# EAGLE design tree2023 (EAGLE 9.6.2)
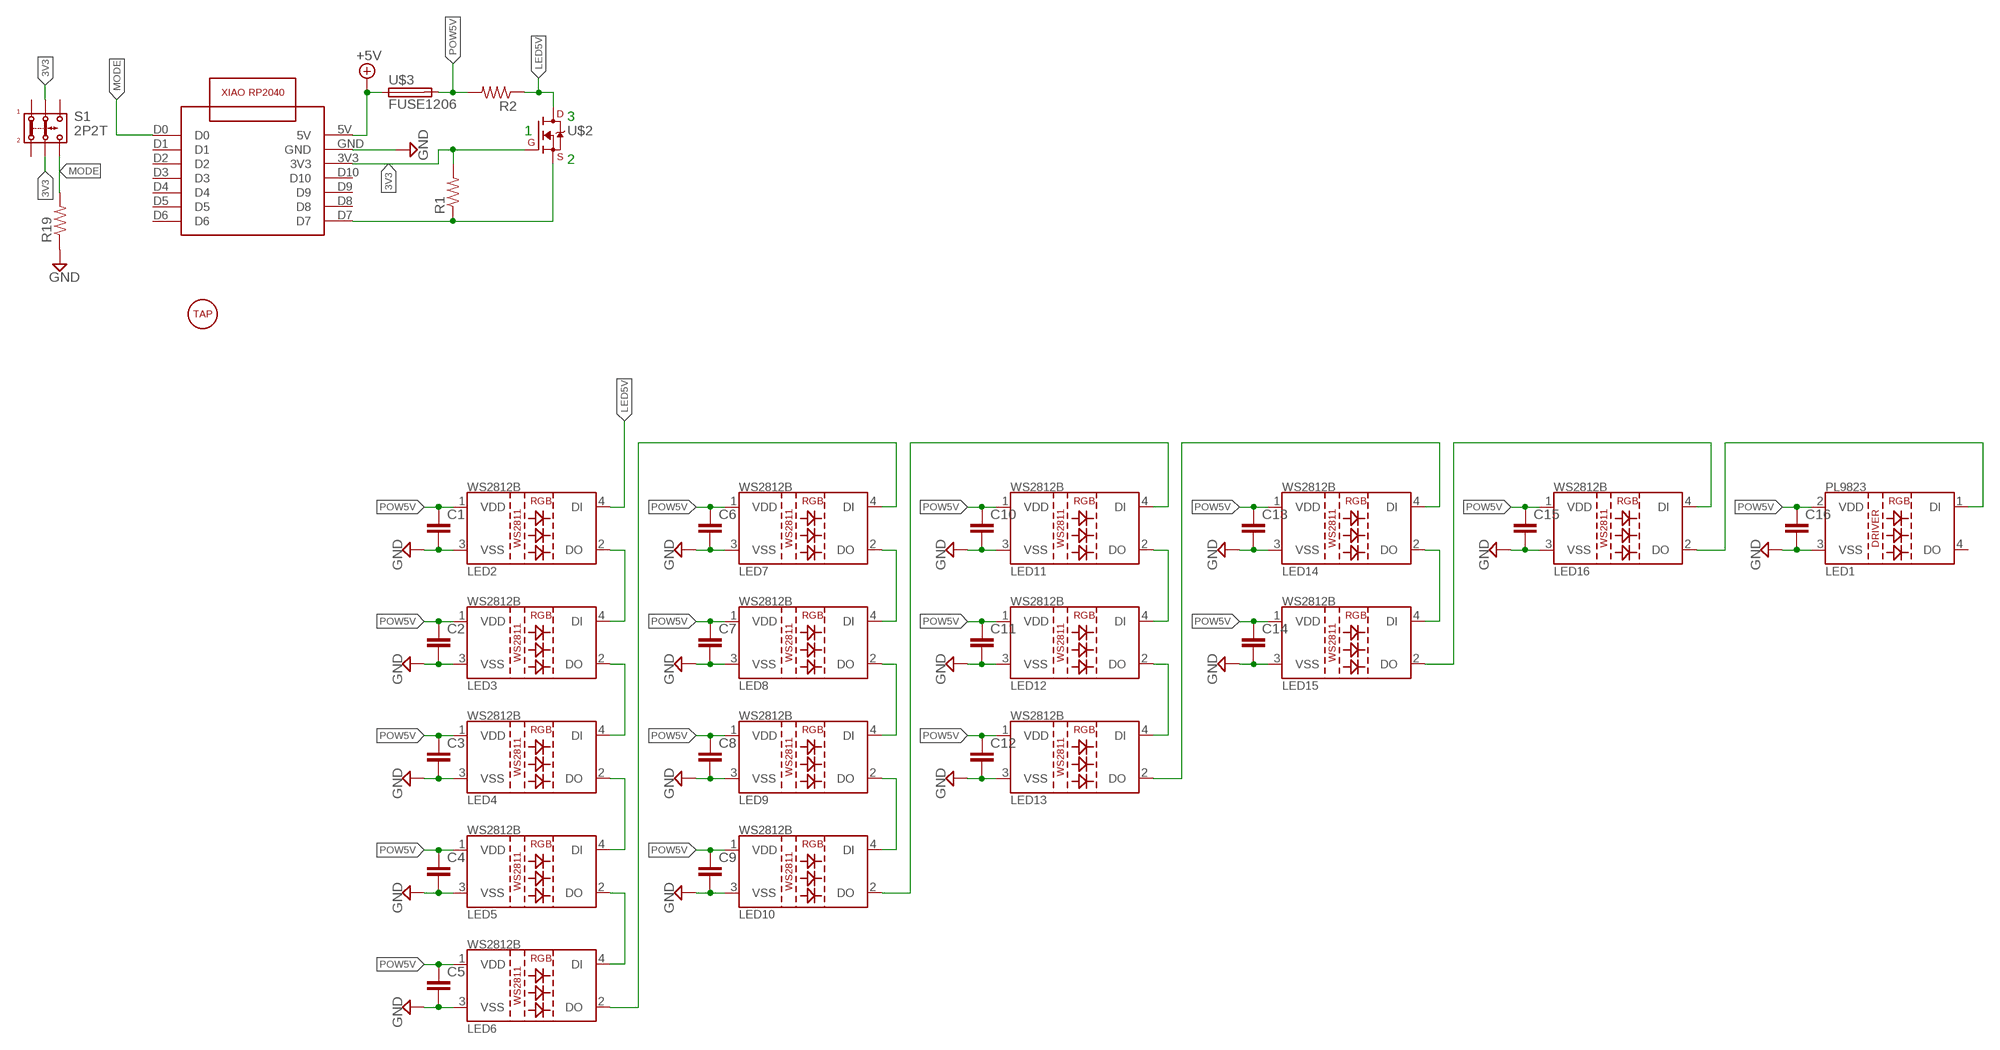
[diagram p0: schematic, sheet 1]

## Parts
C1  C-EUC0805  [C0805]
C2  C-EUC0805  [C0805]
C3  C-EUC0805  [C0805]
C4  C-EUC0805  [C0805]
C5  C-EUC0805  [C0805]
C6  C-EUC0805  [C0805]
C7  C-EUC0805  [C0805]
C8  C-EUC0805  [C0805]
C9  C-EUC0805  [C0805]
C10  C-EUC0805  [C0805]
C11  C-EUC0805  [C0805]
C12  C-EUC0805  [C0805]
C13  C-EUC0805  [C0805]
C14  C-EUC0805  [C0805]
C15  C-EUC0805  [C0805]
C16  C-EUC0805  [C0805]
LED1  LED-PL9823-F5  [LED-PL9823-F5]
LED2  LED-WS2812B  [LED-WS2812B]
LED3  LED-WS2812B  [LED-WS2812B]
LED4  LED-WS2812B  [LED-WS2812B]
LED5  LED-WS2812B  [LED-WS2812B]
LED6  LED-WS2812B  [LED-WS2812B]
LED7  LED-WS2812B  [LED-WS2812B]
LED8  LED-WS2812B  [LED-WS2812B]
LED9  LED-WS2812B  [LED-WS2812B]
LED10  LED-WS2812B  [LED-WS2812B]
LED11  LED-WS2812B  [LED-WS2812B]
LED12  LED-WS2812B  [LED-WS2812B]
LED13  LED-WS2812B  [LED-WS2812B]
LED14  LED-WS2812B  [LED-WS2812B]
LED15  LED-WS2812B  [LED-WS2812B]
LED16  LED-WS2812B  [LED-WS2812B]
R1  R-US_R0603  [R0603]
R2  R-US_R0603  [R0603]
R19  R-US_R0603  [R0603]
S1  2P2T  [2P2T]
U$1  XIAO-RP2040FRONT-SMD  [XIAO-RP2040-ASIDE-SMD]
U$2  IRML6344  [SOT23]
U$3  FUSE1206  [F1206]
U$4  TAPHOLE3MM  [TAPHOLE-3MM]

## Nets
3V3: R1.2 S1.2.1 S1.2.2 U$1.3V3 U$2.1(G)
+5V: U$1.5V U$3.1
GND: C1.2 C2.2 C3.2 C4.2 C5.2 C6.2 C7.2 C8.2 C9.2 C10.2 C11.2 C12.2 C13.2 C14.2 C15.2 C16.2 LED1.3(VSS) LED2.3(VSS) LED3.3(VSS) LED4.3(VSS) LED5.3(VSS) LED6.3(VSS) LED7.3(VSS) LED8.3(VSS) LED9.3(VSS) LED10.3(VSS) LED11.3(VSS) LED12.3(VSS) LED13.3(VSS) LED14.3(VSS) LED15.3(VSS) LED16.3(VSS) R19.1 U$1.GND
LED5V: LED2.4(DI) R2.1 U$2.3(D)
MODE: R19.2 S1.3.2 U$1.D0
N$1: LED2.2(DO) LED3.4(DI)
N$2: LED3.2(DO) LED4.4(DI)
N$3: LED4.2(DO) LED5.4(DI)
N$4: LED5.2(DO) LED6.4(DI)
N$5: LED6.2(DO) LED7.4(DI)
N$6: LED7.2(DO) LED8.4(DI)
N$7: LED8.2(DO) LED9.4(DI)
N$8: LED9.2(DO) LED10.4(DI)
N$9: LED10.2(DO) LED11.4(DI)
N$10: LED11.2(DO) LED12.4(DI)
N$11: LED12.2(DO) LED13.4(DI)
N$12: LED13.2(DO) LED14.4(DI)
N$13: LED14.2(DO) LED15.4(DI)
N$14: LED15.2(DO) LED16.4(DI)
N$15: LED1.1(DI) LED16.2(DO)
N$18: R1.1 U$1.D7 U$2.2(S)
POW5V: C1.1 C2.1 C3.1 C4.1 C5.1 C6.1 C7.1 C8.1 C9.1 C10.1 C11.1 C12.1 C13.1 C14.1 C15.1 C16.1 LED1.2(VDD) LED2.1(VDD) LED3.1(VDD) LED4.1(VDD) LED5.1(VDD) LED6.1(VDD) LED7.1(VDD) LED8.1(VDD) LED9.1(VDD) LED10.1(VDD) LED11.1(VDD) LED12.1(VDD) LED13.1(VDD) LED14.1(VDD) LED15.1(VDD) LED16.1(VDD) R2.2 U$3.2
Unconnected: LED1.4(DO) S1.1.1 S1.1.2 S1.3.1 U$1.D1 U$1.D2 U$1.D3 U$1.D4 U$1.D5 U$1.D6 U$1.D8 U$1.D9 U$1.D10

## Notes on the sheet
- 3
- 1
- 2

## Library data of the parts
C1-C16 = 0my:C-EU: CAPACITOR, European symbol
LED1 = Ai_LED:LED-PL9823
LED2-LED16 = Ai_LED:LED-WS2812B
R1 R2 R19 = 0my:R-US_: RESISTOR, American symbol
S1 = 0my:2P2T: SLIDE SWITCH DPDT SMD
U$1 = rp2040:XIAO-RP2040
U$2 = xiao:IRML6344
U$3 = ch552:FUSE
U$4 = 0my:TAPHOLE

## Board
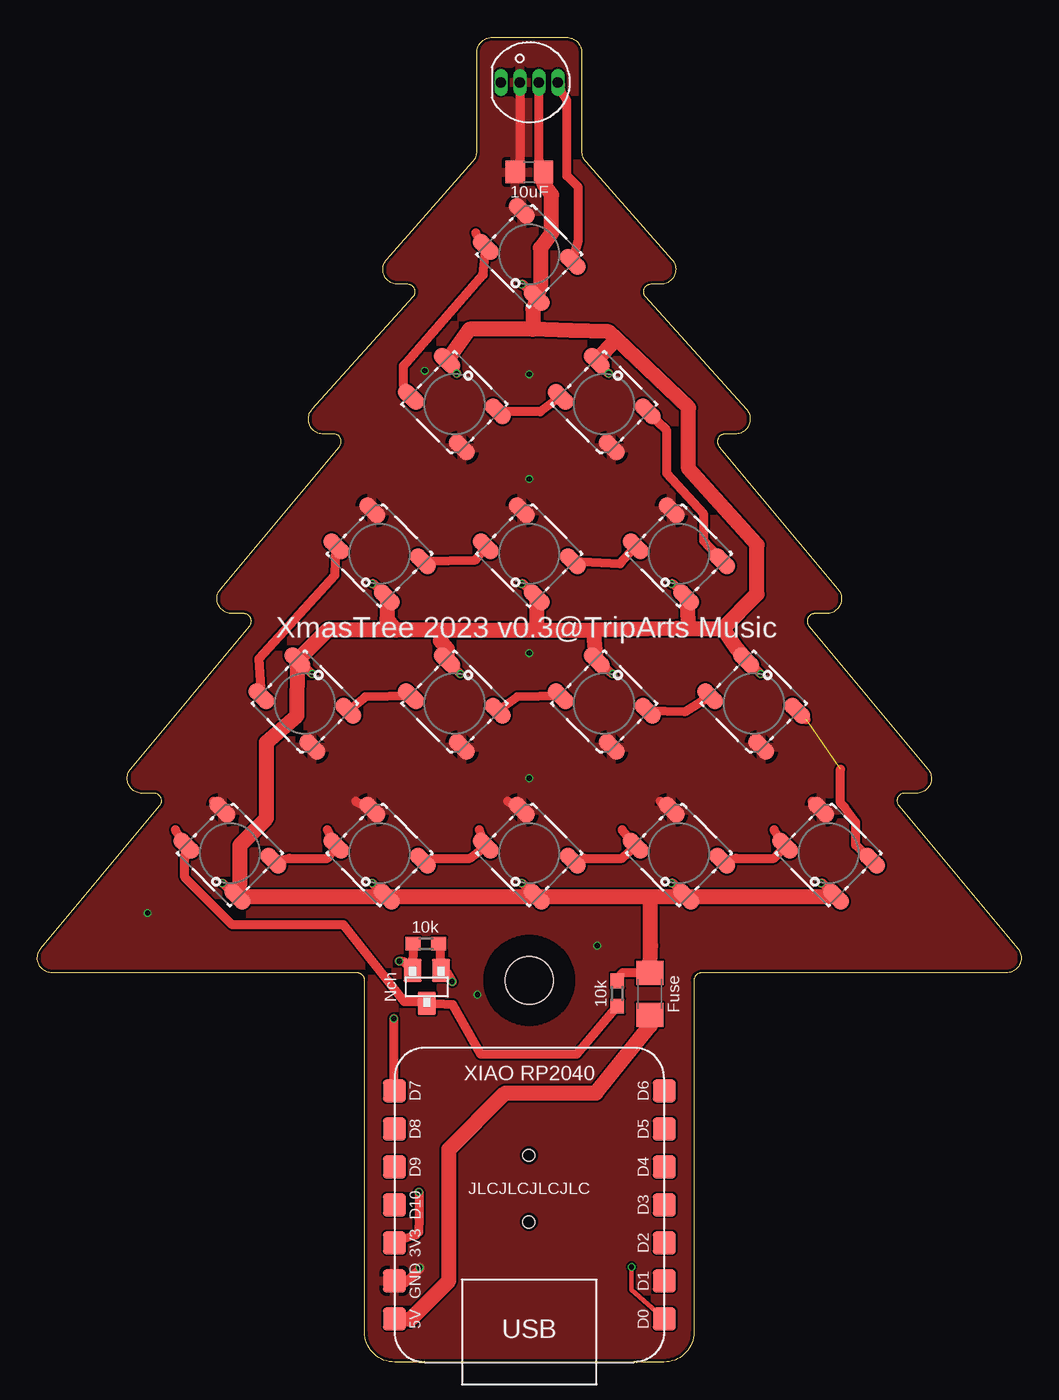
[diagram p1: board, top side]
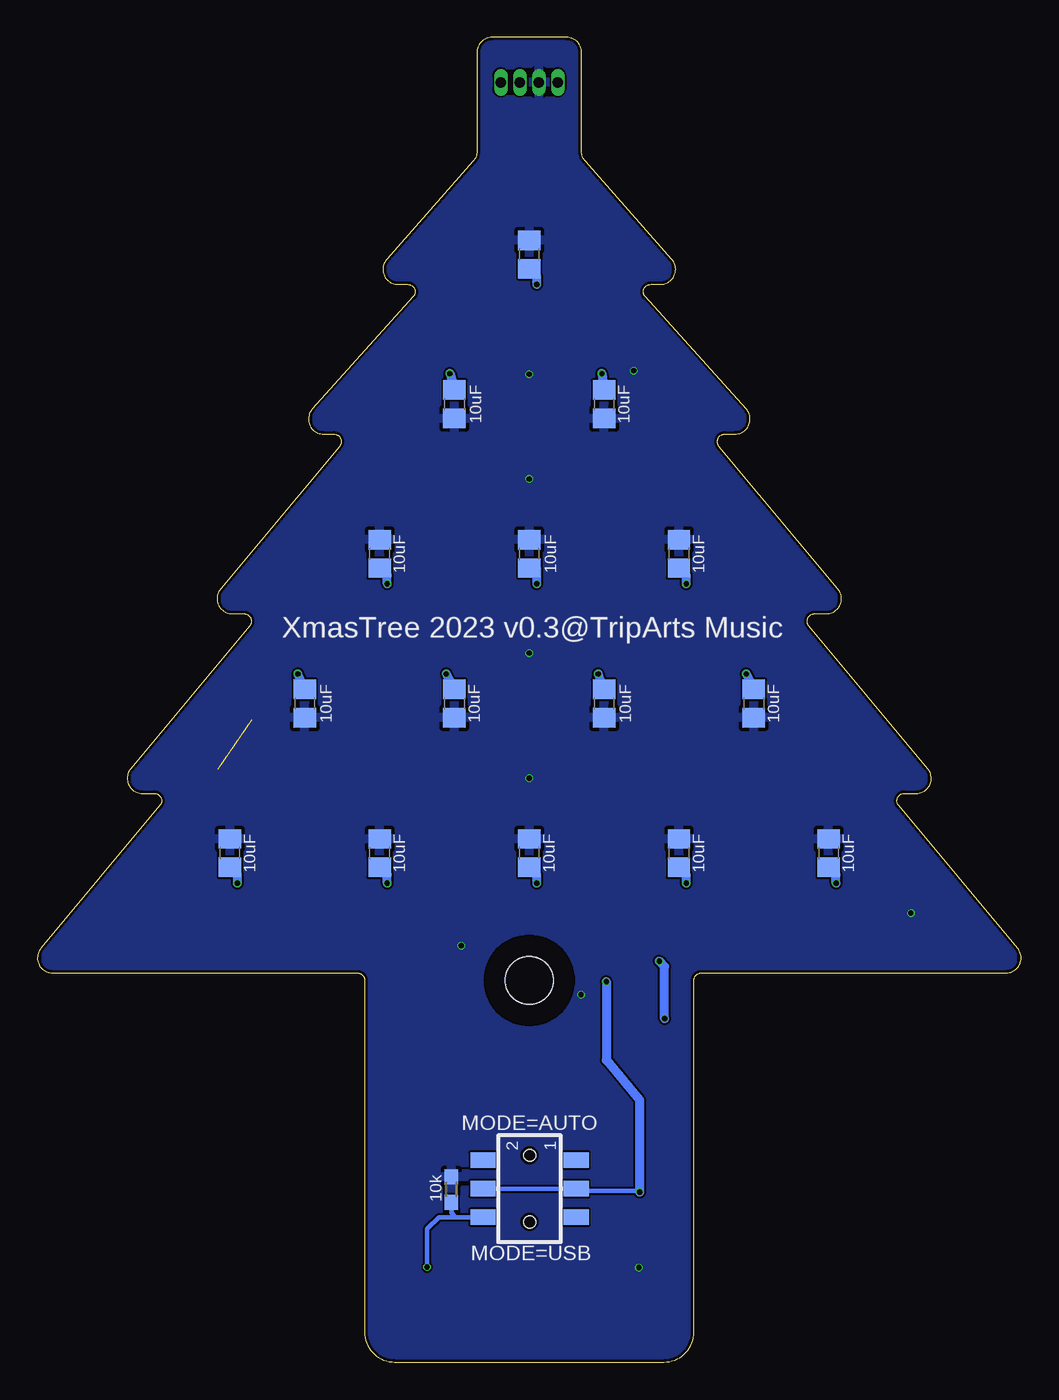
[diagram p2: board, bottom side, seen from below]

Size 65.73 x 88.5 mm. Coordinates in mm from the lower left corner, seen from the top.
Outline: 23.33,73.66 29.11,80.22 arc41 29.36,80.88 29.36,87.5 arc-90 30.36,88.5 35.36,88.5 arc-90 36.36,87.5 36.36,80.88 arc41 36.61,80.22 42.4,73.66 arc-131 41.65,72 40.99,72 arc132 40.62,71.17 47.36,63.67 arc-132 46.62,62 45.93,62 arc130 45.55,61.18 53.5,51.64 arc-130 52.73,50 51.93,50 arc130 51.55,49.18 59.5,39.64 arc-130 58.73,38 57.93,38 arc130 57.55,37.18 65.5,27.64 arc-130 64.73,26 44.36,26 arc90 43.86,25.5 43.86,2 arc-90 41.86,0 23.86,0 arc-90 21.86,2 21.86,25.5 arc90 21.36,26 1,26 arc-130 0.23,27.64 8.18,37.18 arc130 7.8,38 7,38 arc-130 6.23,39.64 14.18,49.18 arc130 13.8,50 13,50 arc-130 12.23,51.64 20.18,61.18 arc130 19.8,62 19.11,62 arc-132 18.37,63.67 25.11,71.17 arc132 24.74,72 24.08,72 arc-131 23.33,73.66
Copper layers (1*16): Top 0.035mm / dielectric 1.6mm / Bottom 0.035mm
Design rules "jlcpcb-2layers *": minimum track width 5mil, minimum drill 0.3mm, track to track 5mil, track to pad 5mil, pad to pad 5mil, via to via 5mil, smd to smd 5mil, copper to edge 0.2mm, drill to drill 6mil, minimum pad ring 2mil, minimum via ring 3mil, stop-mask expansion 4mil, vias tented up to drill 0mil, thermal gap 10mil

### Footprints (pad centres in the part's own frame; a part is rotated, then mirrored left to right if it is on the bottom)
C0805 = smd 1.3 x 1.5: 1 -0.95,0; 2 0.95,0
LED-PL9823-F5 = drill 0.711 pad 0.889 long: 1 -1.905,0; 2 -0.635,0; 3 0.635,0; 4 1.905,0
LED-WS2812B = smd 2 x 1.1: 1 -2.4,1.7; 2 -2.4,-1.7; 3 2.4,-1.7; 4 2.4,1.7
R0603 = smd 1 x 0.9: 1 -0.85,0; 2 0.85,0
2P2T = smd 1.016 x 1.676: 1.1 1.905,5.334; 1.2 1.905,-0.889; 2.1 3.81,5.334; 2.2 3.81,-0.889; 3.1 5.715,5.334; 3.2 5.715,-0.889 | hole 0.8: 1.587,2.223; 6.032,2.223
XIAO-RP2040-ASIDE-SMD = smd 1.524 x 1.524: 3V3 9.017,2.54; 5V 9.017,7.62; D0 -9.017,7.62; D1 -9.017,5.08; D2 -9.017,2.54; D3 -9.017,0; D4 -9.017,-2.54; D5 -9.017,-5.08; D6 -9.017,-7.62; D7 9.017,-7.62; D8 9.017,-5.08; D9 9.017,-2.54; D10 9.017,0; GND 9.017,5.08
SOT23 = smd 1.5 x 1.2: 1 -1.1,0.95; 2 -1.1,-0.95; 3 1.1,0
F1206 = smd 1.6 x 1.8: 1 -1.4,0; 2 1.4,0
TAPHOLE-3MM = hole 3.2: 0,0

### Placement (x,y rotation side)
C1  12.86,34 90 bottom
C2  22.86,34 90 bottom
C3  32.86,34 90 bottom
C4  42.86,34 90 bottom
C5  52.86,34 90 bottom
C6  47.86,44 270 bottom
C7  37.86,44 270 bottom
C8  27.86,44 270 bottom
C9  17.86,44 270 bottom
C10  22.86,54 90 bottom
C11  32.86,54 90 bottom
C12  42.86,54 90 bottom
C13  37.86,64 270 bottom
C14  27.86,64 270 bottom
C15  32.86,74 90 bottom
C16  32.86,79.5 180 top
LED1  32.86,85.5 180 top
LED2  12.86,34 135 top
LED3  22.86,34 135 top
LED4  32.86,34 135 top
LED5  42.86,34 135 top
LED6  52.86,34 135 top
LED7  47.86,44 315 top
LED8  37.86,44 315 top
LED9  27.86,44 315 top
LED10  17.86,44 315 top
LED11  22.86,54 135 top
LED12  32.86,54 135 top
LED13  42.86,54 135 top
LED14  37.86,64 315 top
LED15  27.86,64 315 top
LED16  32.86,74 135 top
R1  25.95,27.95 0 top
R2  38.74,24.63 90 top
R19  38.06,11.54 270 bottom
S1  35.06,15.4 270 bottom
U$1  32.86,10.5 180 top
U$2  26.02,25.07 270 top
U$3  40.92,24.61 90 top
U$4  32.86,25.5 0 top

### Tracks (layer width: path | path; a pad name or v marks a point on that pad's centre or on a via)
3V3  (via drill 0.35)
  Top 0.61: R1.2 26.93,27.81 U$2.1 27.32,26.05 v27.71,25.42 | v25.49,11.37 25.49,9.61 25.48,8.69 25.28,8.5 U$1.3V3
  Bottom 0.305: v25.49,11.37 25.56,11.43 29.57,11.43 S1.2.1 S1.2.2
  Bottom 0.61: v27.71,25.42 27.71,20.19 25.49,17.51 v25.49,11.37
+5V
  Top 1.016: U$1.5V 24.92,2.85 27.5,5.44 27.5,14.22 31.25,17.98 37.33,17.98 40.93,22.45 U$3.1
GND  (via drill 0.35)
  Top 0.61: LED1.3 32.23,80.31 C16.2 | 41.6,37.47 LED5.3 | 51.76,37.47 LED6.3 | 31.44,37.47 LED4.3 | 21.28,37.47 LED3.3 | 11.75,37.47 LED2.3 | v25.54,6.31 25.52,6.19 24.24,5.01 U$1.GND | 31.82,77.22 LED16.3
  other vias: 37.4,27.82 32.86,39 32.86,47.37 32.86,59 32.86,66 25.88,66.24 29.4,24.55 7.36,30
  pour Top: 26.86,90 38.86,90 38.86,82 74.86,24 46.86,24 46.86,0 18.86,0 18.86,24 -9.14,24 26.86,82
  pour Bottom: 26.86,90 38.86,90 38.86,82 74.86,24 46.86,24 46.86,0 18.86,0 18.86,24 -9.14,24 26.86,82
LED5V
  Top 0.61: R2.1 36.02,20.57 29.63,20.57 27.77,23.87 U$2.3 25.53,24.07 24.52,24.07 20.45,29.21 13.02,29.21 9.85,32.38 9.85,33.66 LED2.4 9.21,35.56
MODE  (via drill 0.35)
  Top 0.305: v39.69,6.35 39.69,4.83 U$1.D0
  Bottom 0.305: S1.3.2 37.79,9.69 | 37.79,9.69 38.9,9.69 39.69,8.89 v39.69,6.35 | 37.79,9.69 38.06,9.96 R19.2
N$1
  Top 0.61: LED2.2 16.83,33.66 19.37,33.66 LED3.4 19.37,35.56
N$2
  Top 0.61: LED3.2 26.36,33.66 28.9,33.66 LED4.4 29.53,35.56
N$3
  Top 0.61: 39.06,35.56 LED5.4 39.06,33.66 36.52,33.66 LED4.2
N$4
  Top 0.61: LED5.2 46.68,33.66 49.22,33.66 LED6.4 49.22,35.56
N$5  (1 unrouted)
  Top 0.61: LED6.2 54.68,34.54 54.68,36.07 53.92,37.08 53.66,37.34 53.66,39.62 | 51.38,42.93 LED7.4
N$6
  Top 0.61: LED7.2 43.25,43.43 LED8.4
N$7
  Top 0.61: LED8.2 32.07,44.45 LED9.4
N$8
  Top 0.61: LED9.2 21.91,44.45 LED10.4
N$9
  Top 0.61: LED10.2 14.8,46.99 19.88,52.58 LED11.4
N$10
  Top 0.61: LED11.2 29.28,53.59 LED12.4
N$11
  Top 0.61: LED12.2 38.93,53.34 LED13.4
N$12
  Top 0.61: LED13.2 44.52,54.86 44.52,56.64 42.05,59.37 42.05,62.22 40.76,63.48 LED14.4
N$13
  Top 0.61: LED14.2 33.6,63.5 LED15.4
N$14
  Top 0.61: LED15.2 24.45,65.28 24.45,66.55 29.79,72.64 LED16.4 29.28,75.44
N$15
  Top 0.61: LED16.2 36.14,74.93 36.14,78.49 35.38,79.25 35.38,84.27 34.98,84.87 34.96,85.31 LED1.1
N$18  (via drill 0.35)
  Top 0.61: R1.1 U$2.2 24.49,26.75 v24.18,26.79 | U$1.D7 23.83,19.62 23.82,19.63 v23.82,22.94
  Bottom 0.61: v23.82,22.94 23.82,26.43 v24.18,26.79
POW5V  (via drill 0.35)
  Top 0.61: C16.1 33.5,80.31 LED1.2 | LED2.1 13.26,31.1 v12.36,32 | LED3.1 23.26,31.1 v22.36,32 | LED4.1 33.26,31.1 v32.36,32 | LED5.1 42.46,32 v42.36,32 | LED6.1 52.46,32 v52.36,32 | LED11.1 22.46,52 v22.36,52 | LED12.1 32.46,52 v32.36,52 | LED13.1 42.46,52 v42.36,52 | LED16.1 32.46,72 v32.36,72 | U$3.2 39.1,26.01 38.72,25.59 R2.2 | LED10.1 v18.36,45.97 | LED9.1 v28.26,45.97 | LED8.1 v38.42,45.97 | LED7.1 v48.33,45.97 | LED15.1 v28.01,66.04 | LED14.1 v38.17,66.04
  Top 1.016: 40.96,31.1 LED4.1 LED3.1 LED2.1 13.53,32 13.53,34.54 15.31,36.32 15.31,41.4 17.34,43.18 LED10.1 19.37,48.9 23.96,48.9 | 40.96,31.1 LED5.1 LED6.1 | C16.1 33.81,78.73 34.36,77.98 34.36,75.44 33.6,74.42 33.6,71.88 LED16.1 33.1,70.36 33.1,69 33.09,69 | U$3.2 40.96,27.81 40.96,31.1 | 26.93,48.9 23.96,48.9 | LED11.1 23.36,49.66 23.96,48.9 | 26.93,48.9 26.93,48.2 27.37,47.67 LED9.1 | 26.93,48.9 33.34,48.9 | 33.34,48.9 37.15,48.9 | LED12.1 33.34,48.9 | LED8.1 37.15,48.9 | 33.09,69 28.86,69 LED15.1 | 45.79,49.02 46.73,47.64 LED7.1 | 43.5,49.02 42.74,49.02 37.15,48.9 | 43.5,49.02 45.79,49.02 | 38.68,68.34 43.5,63.75 43.5,59.69 48.08,54.61 48.08,51.31 45.79,49.02 | 38.68,68.34 38.17,68.83 35.62,68.92 33.09,69 | LED14.1 38.68,68.34 | LED13.1 43.5,49.02
  Bottom 0.61: C1.1 12.36,32.55 v12.36,32 | C2.1 22.36,32.55 v22.36,32 | C3.1 32.36,32.55 v32.36,32 | C4.1 42.36,32.55 v42.36,32 | v52.36,32 52.36,32.55 C5.1 | C10.1 22.36,52.55 v22.36,52 | v32.36,52 32.36,53 32.41,53.05 C11.1 | C12.1 42.36,52.55 v42.36,52 | v32.36,72 32.36,72.55 C15.1 | v18.36,45.97 C9.1 | v28.26,45.97 C8.1 | v38.42,45.97 C7.1 | v48.33,45.97 C6.1 | v28.01,66.04 C14.1 | v38.17,66.04 C13.1

### Text on the board
tPlace: XmasTree 2023 v0.3@TripArts Music | JLCJLCJLCJLC
bPlace: XmasTree 2023 v0.3@TripArts Music | MODE=AUTO | MODE=USB
tNames: 10uF | 10k | Nch | 10k | Fuse
bNames: 10uF | 10uF | 10uF | 10uF | 10uF | 10uF | 10uF | 10uF | 10uF | 10uF | 10uF | 10uF | 10uF | 10uF | 10k